# Altium project DMEM_Mezzanine.PrjPcb
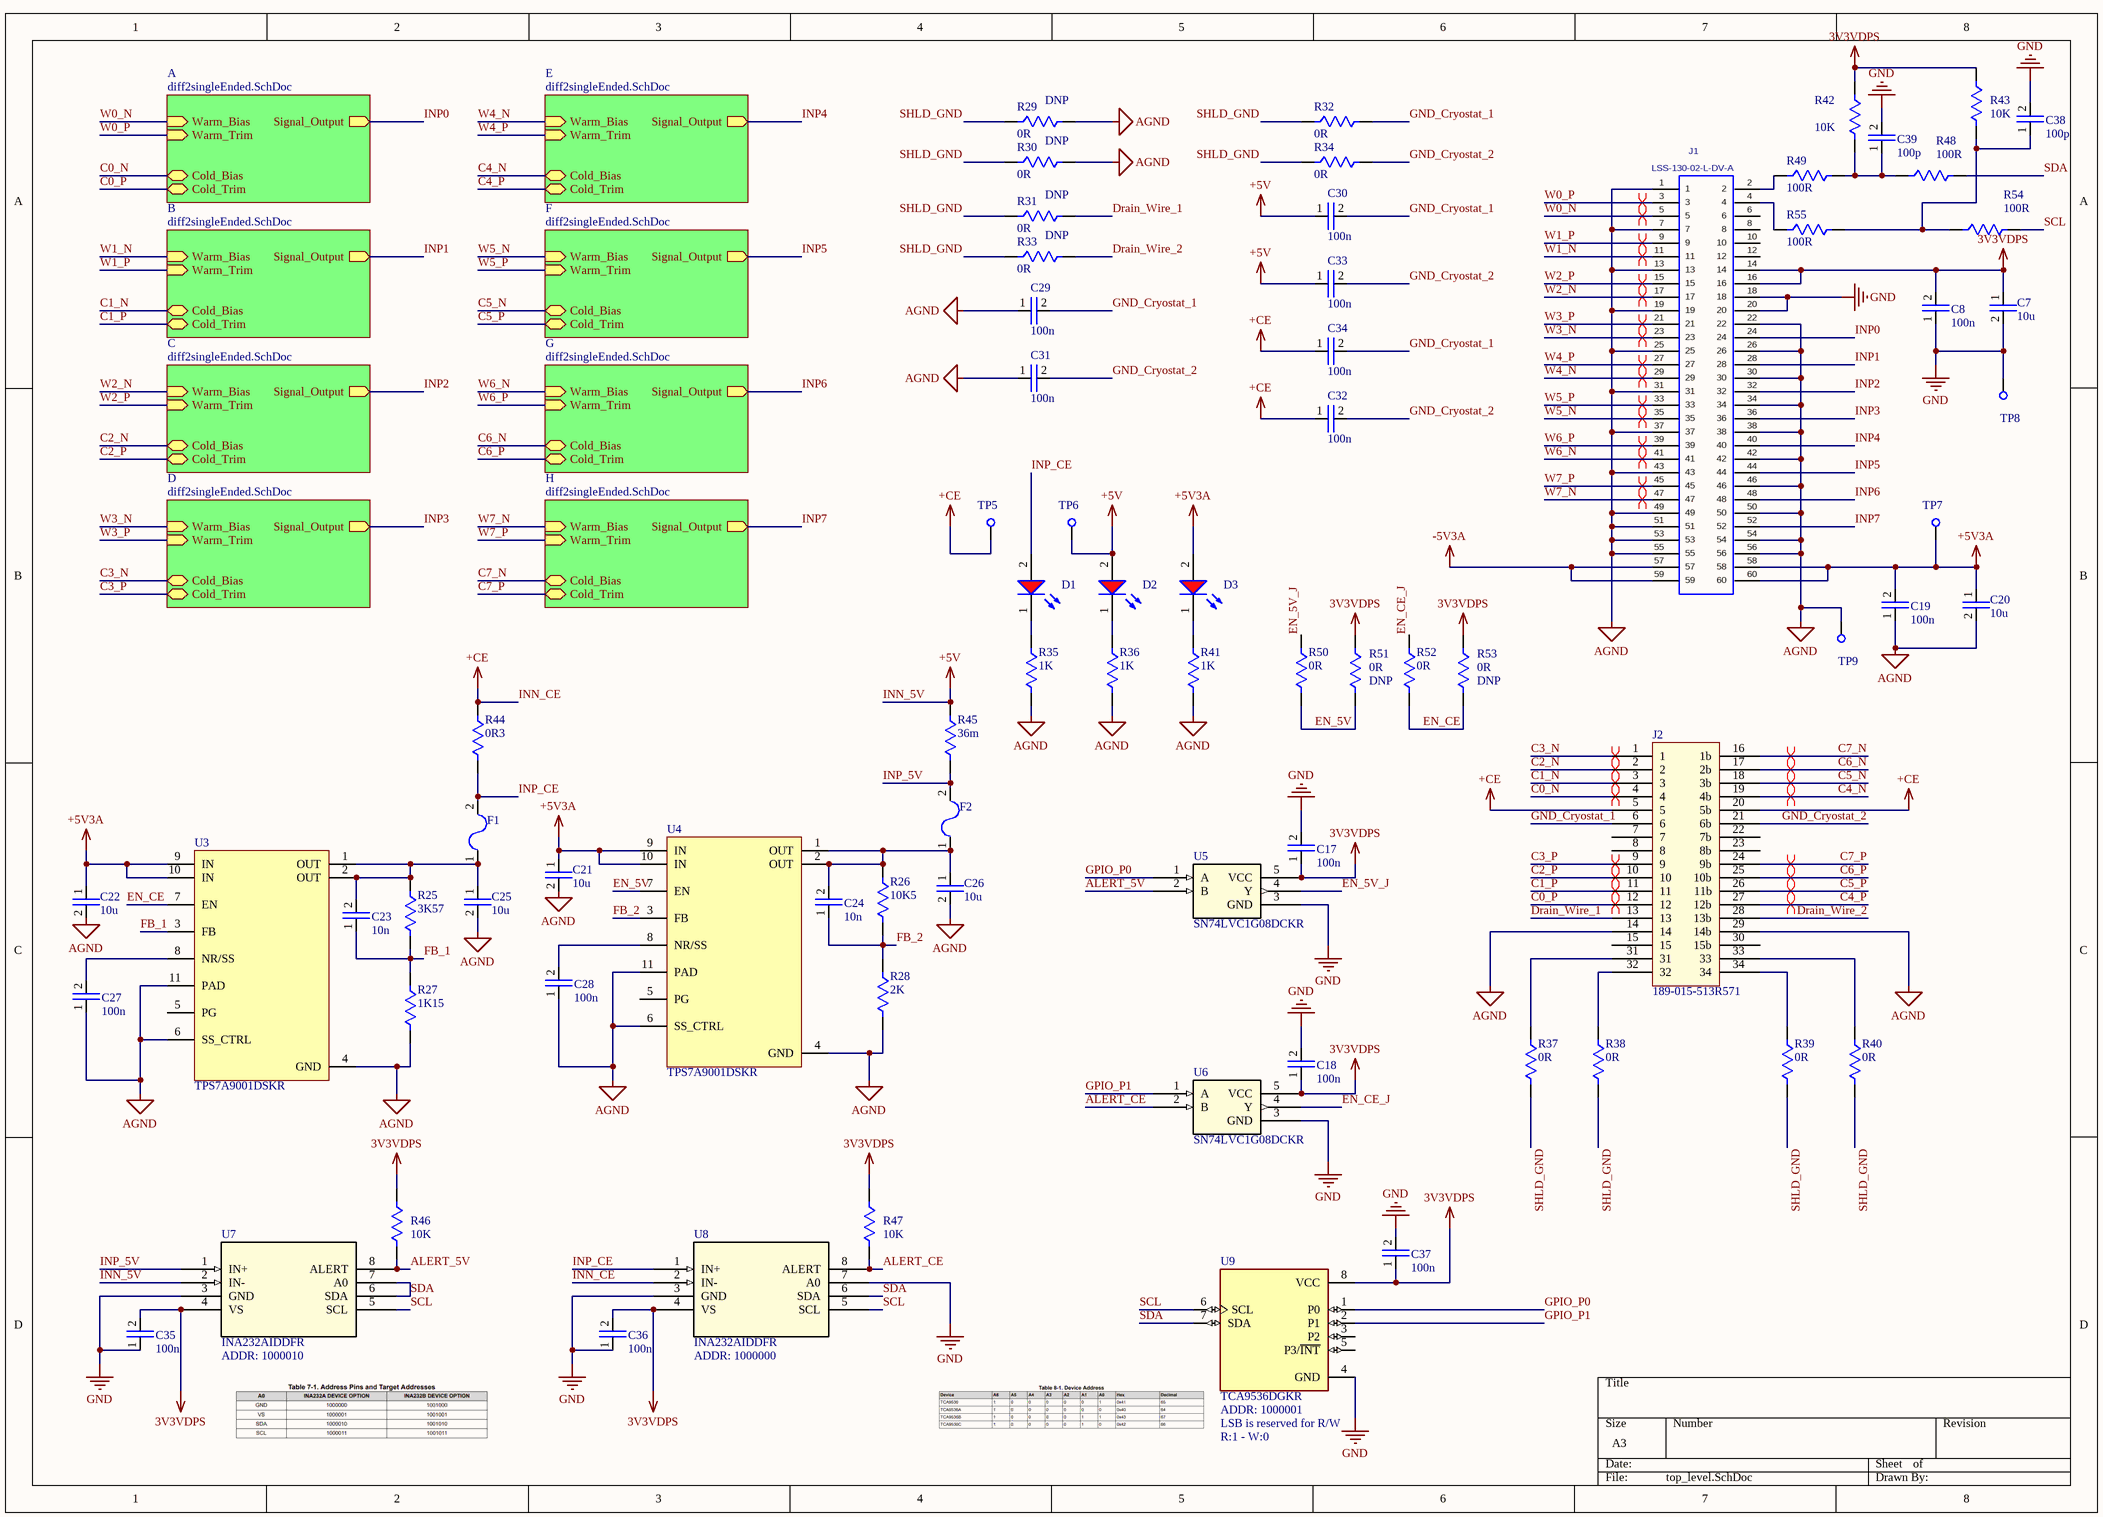
[diagram p0: top_level.SchDoc]
2 sheets, 443 parts. Net scope: hierarchical (ports join the sheet entries above them; power ports are global).
Board file: PCB_DMEM_Mezzanine.PcbDoc
Sheets:
  top_level.SchDoc
    A = diff2singleEnded.SchDoc
    B = diff2singleEnded.SchDoc
    C = diff2singleEnded.SchDoc
    D = diff2singleEnded.SchDoc
    E = diff2singleEnded.SchDoc
    F = diff2singleEnded.SchDoc
    G = diff2singleEnded.SchDoc
    H = diff2singleEnded.SchDoc

## Sheet top_level.SchDoc
size A3; SheetNumber: 1; SheetTotal: 2; SPICEModelCacheETIYLMLX: <root> / <DocumentId>ETIYLMLX</DocumentId> / <CacheFrame Number="0"> / <Model Name="0603_150060rs75000" Kind="CKT"> / <Text>****** / .subckt 0603_150060RS75000  1  2 / D1 1 2 SMCW / .MODEL SMCW D / + IS=39.260E-18 / + N=2.2264 / + RS=1.0000E-6 / + IKF=.13281 / + CJO=1.0000E-12 / + M=.3333 / + VJ=.75 / + BV=100 / + IBV=10.00E-6 / + TT=5.0000E-9 / .ends</Text> / </Model> / </CacheFrame> / </root>

### Parts
C7  value 10u  [CAPC3216X190N]  (hidden comment: C3216X6S2A106K160AC)
C8  value 100n  [CAPC1608X09N]  (hidden comment: CC0603KRX7R0BB104)
C17  value 100n  [CAPC1608X09N]  (hidden comment: CC0603KRX7R0BB104)
C18  value 100n  [CAPC1608X09N]  (hidden comment: CC0603KRX7R0BB104)
C19  value 100n  [CAPC1608X09N]  (hidden comment: CC0603KRX7R0BB104)
C20  value 10u  [CAPC3216X190N]  (hidden comment: C3216X6S2A106K160AC)
C21  value 10u  [CAPC3216X190N]  (hidden comment: C3216X6S2A106K160AC)
C22  value 10u  [CAPC3216X190N]  (hidden comment: C3216X6S2A106K160AC)
C23  value 10n  [CAPC1608X09N]  (hidden comment: 0603B103K500CT)
C24  value 10n  [CAPC1608X09N]  (hidden comment: 0603B103K500CT)
C25  value 10u  [CAPC3216X190N]  (hidden comment: C3216X6S2A106K160AC)
C26  value 10u  [CAPC3216X190N]  (hidden comment: C3216X6S2A106K160AC)
C27  value 100n  [CAPC1608X09N]  (hidden comment: CC0603KRX7R0BB104)
C28  value 100n  [CAPC1608X09N]  (hidden comment: CC0603KRX7R0BB104)
C29  value 100n  [CAPC1608X09N]  (hidden comment: CC0603KRX7R0BB104)
C30  value 100n  [CAPC1608X09N]  (hidden comment: CC0603KRX7R0BB104)
C31  value 100n  [CAPC1608X09N]  (hidden comment: CC0603KRX7R0BB104)
C32  value 100n  [CAPC1608X09N]  (hidden comment: CC0603KRX7R0BB104)
C33  value 100n  [CAPC1608X09N]  (hidden comment: CC0603KRX7R0BB104)
C34  value 100n  [CAPC1608X09N]  (hidden comment: CC0603KRX7R0BB104)
C35  value 100n  [CAPC1608X09N]  (hidden comment: CC0603KRX7R0BB104)
C36  value 100n  [CAPC1608X09N]  (hidden comment: CC0603KRX7R0BB104)
C37  value 100n  [CAPC1608X09N]  (hidden comment: CC0603KRX7R0BB104)
C38  value 100p  [CAPC1608X09N]  (hidden comment: GRM1885C1H101JA01D)
C39  value 100p  [CAPC1608X09N]  (hidden comment: GRM1885C1H101JA01D)
D1  150060RS75000  [WL-SMCW_0603_150060xx75000]  (value not drawn)
D2  150060RS75000  [WL-SMCW_0603_150060xx75000]  (value not drawn)
D3  150060RS75000  [WL-SMCW_0603_150060xx75000]  (value not drawn)
F1  F0603G0R20FNTR  [RESC1608X08N]  (value not drawn)
F2  F0603G0R20FNTR  [RESC1608X08N]  (value not drawn)
J1  LSS-130-02-L-DV-A  [LSS-130-XX-XX-DV-A]
J2  189-015-513R571  [189-015-513R571]
R25  value 3K57  [RESC1608X55N]  (hidden comment: RMCF0603FT3K57)
R26  value 10K5  [RESC1608X55N]  (hidden comment: RMCF0603FT10K5)
R27  value 1K15  [RESC1608X55N]  (hidden comment: RMCF0603FT1K15)
R28  value 2K  [RESC1608X55N]  (hidden comment: ERJ-3EKF2001V)
R29  DNP  value 0R  [RESC1608X55N]
R30  DNP  value 0R  [RESC1608X55N]
R31  DNP  value 0R  [RESC1608X55N]
R32  value 0R  [RESC1608X55N]  (hidden comment: RMCF0603ZT0R00)
R33  DNP  value 0R  [RESC1608X55N]
R34  value 0R  [RESC1608X55N]  (hidden comment: RMCF0603ZT0R00)
R35  value 1K  [RESC1608X55N]  (hidden comment: RT0603BRD071KL)
R36  value 1K  [RESC1608X55N]  (hidden comment: RT0603BRD071KL)
R37  value 0R  [RESC1608X55N]  (hidden comment: RMCF0603ZT0R00)
R38  value 0R  [RESC1608X55N]  (hidden comment: RMCF0603ZT0R00)
R39  value 0R  [RESC1608X55N]  (hidden comment: RMCF0603ZT0R00)
R40  value 0R  [RESC1608X55N]  (hidden comment: RMCF0603ZT0R00)
R41  value 1K  [RESC1608X55N]  (hidden comment: RT0603BRD071KL)
R42  value 10K  [RESC1608X55N]  (hidden comment: RC0603FR-0710KL)
R43  value 10K  [RESC1608X55N]  (hidden comment: RC0603FR-0710KL)
R44  value 0R3  [RESC1608X55N]  (hidden comment: ERJ-3RQFR30V)
R45  value 36m  [RESC1608X55N]  (hidden comment: ERJ-3BWFR036V)
R46  value 10K  [RESC1608X55N]  (hidden comment: RC0603FR-0710KL)
R47  value 10K  [RESC1608X55N]  (hidden comment: RC0603FR-0710KL)
R48  value 100R  [RESC1608X55N]  (hidden comment: RC0603FR-07100RL)
R49  value 100R  [RESC1608X55N]  (hidden comment: RC0603FR-07100RL)
R50  value 0R  [RESC1608X55N]  (hidden comment: RMCF0603ZT0R00)
R51  DNP  value 0R  [RESC1608X55N]
R52  value 0R  [RESC1608X55N]  (hidden comment: RMCF0603ZT0R00)
R53  DNP  value 0R  [RESC1608X55N]
R54  value 100R  [RESC1608X55N]  (hidden comment: RC0603FR-07100RL)
R55  value 100R  [RESC1608X55N]  (hidden comment: RC0603FR-07100RL)
TP5  testPoint_throughHole  [testPoint_ThroughHole]  (value not drawn)
TP6  testPoint_throughHole  [testPoint_ThroughHole]  (value not drawn)
TP7  testPoint_throughHole  [testPoint_ThroughHole]  (value not drawn)
TP8  testPoint_throughHole  [testPoint_ThroughHole]  (value not drawn)
TP9  testPoint_throughHole  [testPoint_ThroughHole]  (value not drawn)
U3  TPS7A9001DSKR  [SON50P250X250X80-11N]
U4  TPS7A9001DSKR  [SON50P250X250X80-11N]
U5  SN74LVC1G08DCKR  [DCK5]
U6  SN74LVC1G08DCKR  [DCK5]
U7  INA232AIDDFR  [SOT_32AIDDFR_TEX]
U8  INA232AIDDFR  [SOT_32AIDDFR_TEX]
U9  TCA9536DGKR  [SOP65P490X110-8N]

### Sub-sheets
A = diff2singleEnded.SchDoc: Warm_Bias (in), Warm_Trim (in), Cold_Bias (bidir), Cold_Trim (bidir), Signal_Output (out)
B = diff2singleEnded.SchDoc: Warm_Bias (in), Warm_Trim (in), Cold_Bias (bidir), Cold_Trim (bidir), Signal_Output (out)
C = diff2singleEnded.SchDoc: Warm_Bias (in), Warm_Trim (in), Cold_Bias (bidir), Cold_Trim (bidir), Signal_Output (out)
D = diff2singleEnded.SchDoc: Warm_Bias (in), Warm_Trim (in), Cold_Bias (bidir), Cold_Trim (bidir), Signal_Output (out)
E = diff2singleEnded.SchDoc: Warm_Bias (in), Warm_Trim (in), Cold_Bias (bidir), Cold_Trim (bidir), Signal_Output (out)
F = diff2singleEnded.SchDoc: Warm_Bias (in), Warm_Trim (in), Cold_Bias (bidir), Cold_Trim (bidir), Signal_Output (out)
G = diff2singleEnded.SchDoc: Warm_Bias (in), Warm_Trim (in), Cold_Bias (bidir), Cold_Trim (bidir), Signal_Output (out)
H = diff2singleEnded.SchDoc: Warm_Bias (in), Warm_Trim (in), Cold_Bias (bidir), Cold_Trim (bidir), Signal_Output (out)

### Nets
3V3VDPS: C7.1 C8.2 C17.1 C18.1 C35.2 C36.2 C37.1 J1.14 J1.16 R42.2 R43.2 R46.2 R47.2 R51.2 R53.2 U5.5(VCC) U6.5(VCC) U7.4(VS) U8.4(VS) U9.8(VCC)
+5V3A: C19.2 C20.1 C21.1 C22.1 D3.2(A) J1.58 J1.60 TP7.0 U3.9(IN) U3.10(IN) U4.9(IN) U4.10(IN)
-5V3A: J1.57 J1.59
AGND: C19.1 C20.2 C21.2 C22.2 C25.2 C26.2 C27.1 C28.1 C29.1 C31.1 J1.1 J1.7 J1.13 J1.19 J1.22 J1.25 J1.26 J1.30 J1.31 J1.34 J1.37 J1.38 J1.42 J1.43 J1.46 J1.49 J1.50 J1.51 J1.53 J1.54 J1.55 J1.56 J2.14 J2.29(14b) R27.1 R28.1 R29.1 R30.1 R35.1 R36.1 R41.1 TP9.0 U3.4(GND) U3.6(SS_CTRL) U3.11(PAD) U4.4(GND) U4.6(SS_CTRL) U4.11(PAD)
GND: C7.2 C8.1 C17.2 C18.2 C35.1 C36.1 C37.2 C38.2 C39.2 J1.18 J1.20 TP8.0 U5.3(GND) U6.3(GND) U7.3(GND) U8.3(GND) U8.7(A0) U9.4(GND)
INN_5V: C30.1 C33.1 D2.2(A) R45.2 TP6.0 U7.2(IN-)  [also labelled +5V]
INN_CE: C32.1 C34.1 J2.5 J2.20(5b) R44.2 TP5.0 U8.2(IN-)  [also labelled +CE]
ALERT_5V: R46.1 U5.2(B) U7.8(ALERT)
ALERT_CE: R47.1 U6.2(B) U8.8(ALERT)
C0_N: J2.4 ; sheet A/Cold_Bias
C0_P: J2.12 ; sheet A/Cold_Trim
C1_N: J2.3 ; sheet B/Cold_Bias
C1_P: J2.11 ; sheet B/Cold_Trim
C2_N: J2.2 ; sheet C/Cold_Bias
C2_P: J2.10 ; sheet C/Cold_Trim
C3_N: J2.1 ; sheet D/Cold_Bias
C3_P: J2.9 ; sheet D/Cold_Trim
C4_N: J2.19(4b) ; sheet E/Cold_Bias
C4_P: J2.27(12b) ; sheet E/Cold_Trim
C5_N: J2.18(3b) ; sheet F/Cold_Bias
C5_P: J2.26(11b) ; sheet F/Cold_Trim
C6_N: J2.17(2b) ; sheet G/Cold_Bias
C6_P: J2.25(10b) ; sheet G/Cold_Trim
C7_N: J2.16(1b) ; sheet H/Cold_Bias
C7_P: J2.24(9b) ; sheet H/Cold_Trim
Drain_Wire_1: J2.13 R31.1
Drain_Wire_2: J2.28(13b) R33.1
EN_5V: R50.1 R51.1 U4.7(EN)
EN_5V_J: R50.2 U5.4(Y)
EN_CE: R52.1 R53.1 U3.7(EN)
EN_CE_J: R52.2 U6.4(Y)
FB_1: C23.1 R25.1 R27.2 U3.3(FB)
FB_2: C24.1 R26.1 R28.2 U4.3(FB)
GND_Cryostat_1: C29.2 C30.2 C34.2 J2.6 R32.1
GND_Cryostat_2: C31.2 C32.2 C33.2 J2.21(6b) R34.1
GPIO_P0: U5.1(A) U9.1(P0)
GPIO_P1: U6.1(A) U9.2(P1)
INP0: J1.24 ; sheet A/Signal_Output
INP1: J1.28 ; sheet B/Signal_Output
INP2: J1.32 ; sheet C/Signal_Output
INP3: J1.36 ; sheet D/Signal_Output
INP4: J1.40 ; sheet E/Signal_Output
INP5: J1.44 ; sheet F/Signal_Output
INP6: J1.48 ; sheet G/Signal_Output
INP7: J1.52 ; sheet H/Signal_Output
INP_5V: F2.2 R45.1 U7.1(IN+)
INP_CE: D1.2(A) F1.2 R44.1 U8.1(IN+)
SCL: R54.1 U7.5(SCL) U8.5(SCL) U9.6(SCL)
SDA: R48.1 U7.6(SDA) U7.7(A0) U8.6(SDA) U9.7(SDA)
SHLD_GND: R29.2 R30.2 R31.2 R32.2 R33.2 R34.2 R37.1 R38.1 R39.1 R40.1
W0_N: J1.5 ; sheet A/Warm_Bias
W0_P: J1.3 ; sheet A/Warm_Trim
W1_N: J1.11 ; sheet B/Warm_Bias
W1_P: J1.9 ; sheet B/Warm_Trim
W2_N: J1.17 ; sheet C/Warm_Bias
W2_P: J1.15 ; sheet C/Warm_Trim
W3_N: J1.23 ; sheet D/Warm_Bias
W3_P: J1.21 ; sheet D/Warm_Trim
W4_N: J1.29 ; sheet E/Warm_Bias
W4_P: J1.27 ; sheet E/Warm_Trim
W5_N: J1.35 ; sheet F/Warm_Bias
W5_P: J1.33 ; sheet F/Warm_Trim
W6_N: J1.41 ; sheet G/Warm_Bias
W6_P: J1.39 ; sheet G/Warm_Trim
W7_N: J1.47 ; sheet H/Warm_Bias
W7_P: J1.45 ; sheet H/Warm_Trim
NetC23_2: C23.2 C25.1 F1.1 R25.2 U3.1(OUT) U3.2(OUT)
NetC24_2: C24.2 C26.1 F2.1 R26.2 U4.1(OUT) U4.2(OUT)
NetC27_2: C27.2 U3.8(NR/SS)
NetC28_2: C28.2 U4.8(NR/SS)
NetC38_1: C38.1 R43.1 R54.2 R55.1
NetC39_1: C39.1 R42.1 R48.2 R49.1
NetD1_1: D1.1(K) R35.2
NetD2_1: D2.1(K) R36.2
NetD3_1: D3.1(K) R41.2
NetJ1_2: J1.2 R49.2
NetJ1_4: J1.4 R55.2
NetJ2_31: J2.31 R37.2
NetJ2_32: J2.32 R38.2
NetJ2_33: J2.33 R40.2
NetJ2_34: J2.34 R39.2

Not connected (* = marked no-connect by the designer): J1 6 8 10 12; J2 7 8 15 22(7b) 23(8b) 30(15b); U3 5(PG); U4 5(PG); U9 3(P2) 5(P3/~{INT})

### Layout directives
differential pair: C0_N, C0_P, C1_N, C1_P, C2_N, C2_P, C3_N, C3_P, C4_N, C4_P, C5_N, C5_P, C6_N, C6_P, C7_N, C7_P, W0_N, W0_P, W1_N, W1_P, W2_N, W2_P, W3_N, W3_P, W4_N, W4_P, W5_N, W5_P, W6_N, W6_P, W7_N, W7_P

### Notes on the sheet
- (near U7) ADDR: 1000010
- (near U8) ADDR: 1000000
- (near U9) ADDR: 1000001
- (near U9) LSB is reserved for R/W
- R:1 - W:0

### Library data of the parts
C7 C20-C22 C25 C26 = Capacitor: 10 µF ±10% 100V Ceramic Capacitor X6S 1206 (3216 Metric); MP: C3216X6S2A106K160AC
C8 C17-C19 C27-C37 = Capacitor: 0.1 µF ±10% 100V Ceramic Capacitor X7R 0603 (1608 Metric); MP: CC0603KRX7R0BB104
C23 C24 = Capacitor: 10000 pF ±10% 50V Ceramic Capacitor X7R 0603 (1608 Metric); MP: 0603B103K500CT
C38 C39 = Capacitor: 100 pF ±5% 50V Ceramic Capacitor C0G, NP0 0603 (1608 Metric); MP: GRM1885C1H101JA01D
D1-D3 = 150060RS75000: WL-SMCW Mono-color Chip LED Waterclear, SMT, size 0603, Red, 2V, 140°; Manufacturer: Wurth Elektronik; Case/Size Code: 0603; Chip Technology: AlInGaP; Dominant Wavelength: 625nm; Luminous Intensity: 250mcd; Peak Wavelength: 630nm; Manufacturer Part Number: 150060RS75000; Category: Signal LEDs; Match Code: WL-SMCW; ComponentLink1Description: Website Link; ComponentLink1URL: https://www.we-online.com/redexpert/article/150060RS75000?ad; ComponentLink2Description: Datasheet Link; ComponentLink2URL: https://www.we-online.com/redexpert/spec/150060RS75000?ad; Mount: Surface Mount; Operating Temperature Max: 85°C; Operating Temperature Min: -40°C; Packaging: Tape and Reel; Length: 1.6mm; Width: 0.8mm; Height: 0.7mm; Emitting Color: Red; Forward Voltage: 2V; Viewing Angle: 140°
F1 F2 = Fuse: 200 mA AC 32 V DC Fuse Board Mount (Cartridge Style Excluded) Surface Mount 0603 (1608 Metric); MP: F0603G0R20FNTR
J1 = LSS-130-XX-XX-DV-A: 0.635MM TERMINAL/SOCKET COMB, 60 PINS.; MANUFACTURER: SAMTEC; CREATED: May 11, 2015 - Wendy Xin; PCB DECAL: LSS-130-XX-XX-DV-A
J2 = 189-015-513R571: 15, 15 Position D-Sub - Stacked Receptacle, Female Sockets Connector; MP: 189-015-513R571
R25 = Resistor: 3.57 kOhms ±1% 0.1W, 1/10W Chip Resistor 0603 (1608 Metric) Automotive AEC-Q200 Thick Film; Package: None; Price: None; MP: RMCF0603FT3K57; Availability: Unavailable
R26 = Resistor: 10.5 kOhms ±1% 0.1W, 1/10W Chip Resistor 0603 (1608 Metric) Automotive AEC-Q200 Thick Film; Package: None; Price: None; MP: RMCF0603FT10K5; Availability: Unavailable
R27 = Resistor: 1.15 kOhms ±1% 0.1W, 1/10W Chip Resistor 0603 (1608 Metric) Automotive AEC-Q200 Thick Film; Package: None; Price: None; MP: RMCF0603FT1K15; Availability: Unavailable
R28 = Resistor: 2 kOhms ±1% 0.1W, 1/10W Chip Resistor 0603 (1608 Metric) Automotive AEC-Q200 Thick Film; Package: None; Price: None; MP: ERJ-3EKF2001V; Availability: Unavailable
R29-R31 R33 R51 R53 = Resistor: 0 Ohms Jumper Chip Resistor 0603 (1608 Metric) Automotive AEC-Q200 Thick Film; MP: RMCF0603ZT0R00; Package: None; Price: None; Availability: Unavailable
R32 R34 R37-R40 R50 R52 = Resistor: 0 Ohms Jumper Chip Resistor 0603 (1608 Metric) Automotive AEC-Q200 Thick Film; Package: None; Price: None; MP: RMCF0603ZT0R00; Availability: Unavailable
R35 R36 R41 = Resistor: 1 kOhms ±0.1% 0.1W, 1/10W Chip Resistor 0603 (1608 Metric) Thin Film; Package: None; Price: None; MP: RT0603BRD071KL; Availability: Unavailable
R42 R43 R46 R47 = Resistor: 10 kOhms ±1% 0.1W, 1/10W Chip Resistor 0603 (1608 Metric) Moisture Resistant Thick Film; Package: None; Price: None; MP: RC0603FR-0710KL; Availability: Unavailable
R44 = Resistor: 300 mOhms ±1% 0.1W, 1/10W Chip Resistor 0603 (1608 Metric) Automotive AEC-Q200 Thick Film; Package: None; Price: None; MP: ERJ-3RQFR30V; Availability: Unavailable
R45 = Resistor: 36 mOhms ±1% 0.333W, 1/3W Chip Resistor 0603 (1608 Metric) Automotive AEC-Q200, Current Sense Thick Film; Package: None; Price: None; MP: ERJ-3BWFR036V; Availability: Unavailable
R48 R49 R54 R55 = Resistor: 100 Ohms ±1% 0.1W, 1/10W Chip Resistor 0603 (1608 Metric) Moisture Resistant Thick Film; Package: None; Price: None; MP: RC0603FR-07100RL; Availability: Unavailable
U3 U4 = TPS7A9001DSKR: 500-mA, low-noise, high-PSRR, adjustable ultra-low-dropout voltage regulator with high-accuracy 10-SON -40 to 125; MF: Texas Instruments; Purchase-URL: https://pricing.snapeda.com/search/part/TPS7A9001DSKR/?ref=eda; Price: None; Value: *; Check_prices: https://www.snapeda.com/parts/TPS7A9001DSKR/Texas+Instruments/view-part/?ref=eda; SnapEDA_Link: https://www.snapeda.com/parts/TPS7A9001DSKR/Texas+Instruments/view-part/?ref=snap; Package: WSON-10 Texas Instruments; Availability: In Stock; MP: TPS7A9001DSKR
U5 U6 = SN74LVC1G08DCKR: AND Gate IC 1 Channel SC-70-5; Mfr_Name: Texas Instruments; RefDes: RefDes; Type: Type
U7 U8 = INA232AIDDFR: Current Monitor Regulator High/Low-Side TSOT-23-8; Mfr_Name: Texas Instruments; RefDes: RefDes; Type: Type
U9 = TCA9536DGKR: Remote 4-Bit IÂ²C and SMBus I/O expander with configuration registers; MF: Texas Instruments; Package: None; MP: TCA9536DGKR; Price: None; Availability: In Stock; Purchase-URL: https://pricing.snapeda.com/search/part/TCA9536DGKR/?ref=eda; Check_prices: https://www.snapeda.com/parts/TCA9536DGKR/Texas+Instruments/view-part/?ref=eda; Value: *; SnapEDA_Link: https://www.snapeda.com/parts/TCA9536DGKR/Texas+Instruments/view-part/?ref=snap

## Sheet diff2singleEnded.SchDoc
size A4; SheetNumber: 2; SheetTotal: 2
Used 8 times, as channels A, B, C, D, E, F, G, H. Parts and nets are listed once, with the designators drawn on the sheet.
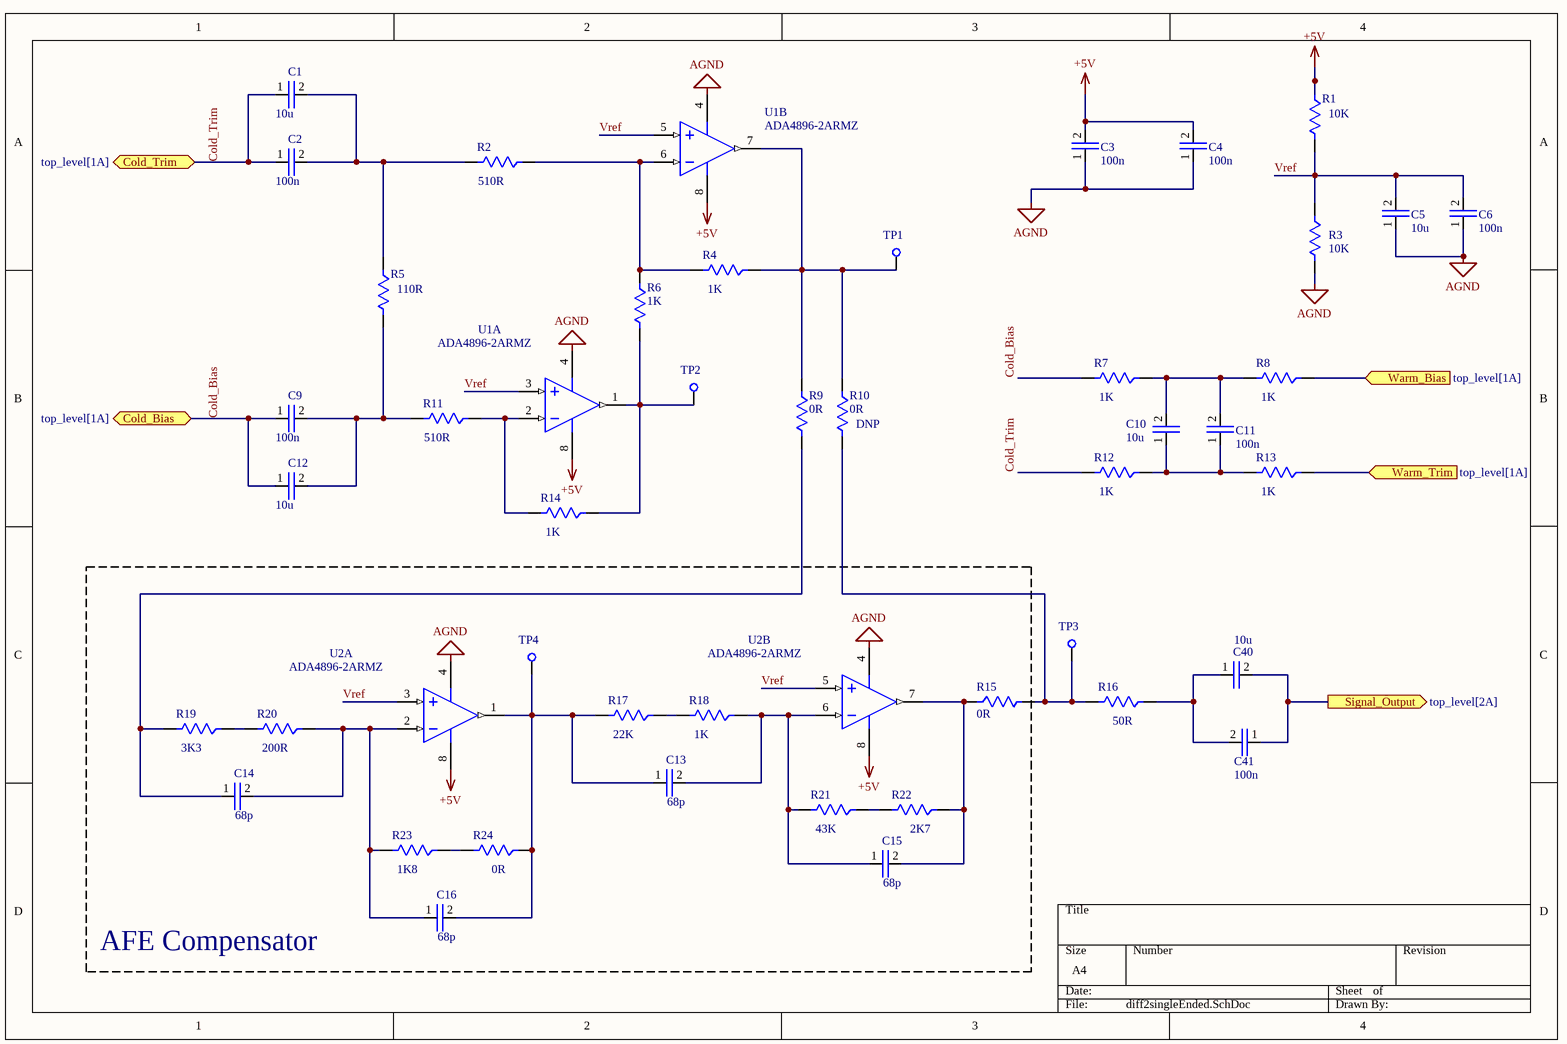
[diagram p1: diff2singleEnded.SchDoc]

### Parts
C1  value 10u  [CAPC3216X190N]  (hidden comment: C3216X6S2A106K160AC)
C2  value 100n  [CAPC1608X09N]  (hidden comment: CC0603KRX7R0BB104)
C3  value 100n  [CAPC1608X09N]  (hidden comment: CC0603KRX7R0BB104)
C4  value 100n  [CAPC1608X09N]  (hidden comment: CC0603KRX7R0BB104)
C5  value 10u  [CAPC3216X190N]  (hidden comment: CL31A106KPHNNNE)
C6  value 100n  [CAPC1608X09N]  (hidden comment: CC0603KRX7R0BB104)
C9  value 100n  [CAPC1608X09N]  (hidden comment: CC0603KRX7R0BB104)
C10  value 10u  [CAPC3216X190N]  (hidden comment: C3216X6S2A106K160AC)
C11  value 100n  [CAPC1608X09N]  (hidden comment: CC0603KRX7R0BB104)
C12  value 10u  [CAPC3216X190N]  (hidden comment: C3216X6S2A106K160AC)
C13  value 68p  [CAPC1608X09N]  (hidden comment: GCM1885C2A680FA16D)
C14  value 68p  [CAPC1608X09N]  (hidden comment: GCM1885C2A680FA16D)
C15  value 68p  [CAPC1608X09N]  (hidden comment: GCM1885C2A680FA16D)
C16  value 68p  [CAPC1608X09N]  (hidden comment: GCM1885C2A680FA16D)
C40  value 10u  [CAPC1608X09N]  (hidden comment: CL10A106KP8NNNC)
C41  value 100n  [CAPC1608X09N]  (hidden comment: CC0603KRX7R0BB104)
R1  value 10K  [RESC1608X55N]  (hidden comment: RC0603FR-0710KL)
R2  value 510R  [RESC1608X55N]  (hidden comment: RT0603BRD07510RL)
R3  value 10K  [RESC1608X55N]  (hidden comment: RC0603FR-0710KL)
R4  value 1K  [RESC1608X55N]  (hidden comment: RT0603BRD071KL)
R5  value 110R  [RESC1608X55N]  (hidden comment: RT0603BRD07110RL)
R6  value 1K  [RESC1608X55N]  (hidden comment: RT0603BRD071KL)
R7  value 1K  [RESC1608X55N]  (hidden comment: RT0603BRD071KL)
R8  value 1K  [RESC1608X55N]  (hidden comment: RT0603BRD071KL)
R9  value 0R  [RESC1608X55N]  (hidden comment: RMCF0603ZT0R00)
R10  DNP  value 0R  [RESC1608X55N]
R11  value 510R  [RESC1608X55N]  (hidden comment: RT0603BRD07510RL)
R12  value 1K  [RESC1608X55N]  (hidden comment: RT0603BRD071KL)
R13  value 1K  [RESC1608X55N]  (hidden comment: RT0603BRD071KL)
R14  value 1K  [RESC1608X55N]  (hidden comment: RT0603BRD071KL)
R15  value 0R  [RESC1608X55N]  (hidden comment: RMCF0603ZT0R00)
R16  value 50R  [RESC1608X55N]  (hidden comment: RT0603BRE0750RL)
R17  value 22K  [RESC1608X55N]  (hidden comment: RT0603BRE0722KL)
R18  value 1K  [RESC1608X55N]  (hidden comment: RT0603BRD071KL)
R19  value 3K3  [RESC1608X55N]  (hidden comment: RT0603BRD073K3L)
R20  value 200R  [RESC1608X55N]  (hidden comment: RT0603BRD07200RL)
R21  value 43K  [RESC1608X55N]  (hidden comment: RT0603BRD0743KL)
R22  value 2K7  [RESC1608X55N]  (hidden comment: RT0603BRD072K7L)
R23  value 1K8  [RESC1608X55N]  (hidden comment: RT0603BRD071K8L)
R24  value 0R  [RESC1608X55N]  (hidden comment: RMCF0603ZT0R00)
TP1  testPoint  [testPoint_pad]  (value not drawn)
TP2  testPoint  [testPoint_pad]  (value not drawn)
TP3  testPoint  [testPoint_pad]  (value not drawn)
TP4  testPoint  [testPoint_pad]  (value not drawn)
U1  ADA4896-2ARMZ  [ADI-RM-8_N]  (parts A,B of 2)
U2  ADA4896-2ARMZ  [ADI-RM-8_N]  (parts A,B of 2)

### Blocks framed on the sheet
AFE Compensator: C13-C16 R15 R17-R24 TP4 U2

### Ports
Cold_Bias (bidir, see top_level[1A]), Cold_Trim (bidir, see top_level[1A]), Signal_Output (out, see top_level[2A]), Warm_Bias (in, see top_level[1A]), Warm_Trim (in, see top_level[1A])

### Nets
+5V: C3.2 C4.2 R1.2 U1.8(+VS) U2.8(+VS)
AGND: C3.1 C4.1 C5.1 C6.1 R3.1 U1.4(-VS) U2.4(-VS)
Cold_Bias: C9.1 C12.1 R7.1 ; port Cold_Bias
Cold_Trim: C1.1 C2.1 R12.1 ; port Cold_Trim
Signal_Output: C40.2 C41.1 ; port Signal_Output
Vref: C5.2 C6.2 R1.1 R3.2 U1.3(+IN_1) U1.5(+IN_2) U2.3(+IN_1) U2.5(+IN_2)
Warm_Bias: R8.2 ; port Warm_Bias
Warm_Trim: R13.2 ; port Warm_Trim
NetC1_2: C1.2 C2.2 R2.1 R5.2
NetC9_2: C9.2 C12.2 R5.1 R11.1
NetC10_1: C10.1 C11.1 R12.2 R13.1
NetC10_2: C10.2 C11.2 R7.2 R8.1
NetC13_1: C13.1 C16.2 R17.1 R24.2 TP4.0 U2.1(OUT_1)
NetC13_2: C13.2 C15.1 R18.2 R21.1 U2.6(-IN_2)
NetC14_1: C14.1 R9.1 R19.1
NetC14_2: C14.2 C16.1 R20.2 R23.1 U2.2(-IN_1)
NetC15_2: C15.2 R15.2 R22.2 U2.7(OUT_2)
NetC40_1: C40.1 C41.2 R16.2
NetR2_2: R2.2 R4.1 R6.2 U1.6(-IN_2)
NetR4_2: R4.2 R9.2 R10.2 TP1.0 U1.7(OUT_2)
NetR6_1: R6.1 R14.2 TP2.0 U1.1(OUT_1)
NetR10_1: R10.1 R15.1 R16.1 TP3.0
NetR11_2: R11.2 R14.1 U1.2(-IN_1)
NetR17_2: R17.2 R18.1
NetR19_2: R19.2 R20.1
NetR21_2: R21.2 R22.1
NetR23_2: R23.2 R24.1

### Channels
A: designators end in _A; ports Cold_Bias=C0_N Cold_Trim=C0_P Signal_Output=INP0 Warm_Bias=W0_N Warm_Trim=W0_P
B: designators end in _B; ports Cold_Bias=C1_N Cold_Trim=C1_P Signal_Output=INP1 Warm_Bias=W1_N Warm_Trim=W1_P
C: designators end in _C; ports Cold_Bias=C2_N Cold_Trim=C2_P Signal_Output=INP2 Warm_Bias=W2_N Warm_Trim=W2_P
D: designators end in _D; ports Cold_Bias=C3_N Cold_Trim=C3_P Signal_Output=INP3 Warm_Bias=W3_N Warm_Trim=W3_P
E: designators end in _E; ports Cold_Bias=C4_N Cold_Trim=C4_P Signal_Output=INP4 Warm_Bias=W4_N Warm_Trim=W4_P
F: designators end in _F; ports Cold_Bias=C5_N Cold_Trim=C5_P Signal_Output=INP5 Warm_Bias=W5_N Warm_Trim=W5_P
G: designators end in _G; ports Cold_Bias=C6_N Cold_Trim=C6_P Signal_Output=INP6 Warm_Bias=W6_N Warm_Trim=W6_P
H: designators end in _H; ports Cold_Bias=C7_N Cold_Trim=C7_P Signal_Output=INP7 Warm_Bias=W7_N Warm_Trim=W7_P

### Library data of the parts
C1 C10 C12 = Capacitor: as C7 on sheet top_level; MP: C3216X6S2A106K160AC
C2-C4 C6 C9 C11 C41 = Capacitor: as C8 on sheet top_level; MP: CC0603KRX7R0BB104
C5 = Capacitor: 10 µF ±10% 10V Ceramic Capacitor X5R 1206 (3216 Metric); MP: CL31A106KPHNNNE
C13-C16 = Capacitor: 68 pF ±1% 100V Ceramic Capacitor C0G, NP0 0603 (1608 Metric); MP: GCM1885C2A680FA16D
C40 = Capacitor: 10 µF ±10% 10V Ceramic Capacitor X5R 0603 (1608 Metric); MP: CL10A106KP8NNNC
R1 R3 = Resistor: as R42 on sheet top_level; Package: None; Price: None; MP: RC0603FR-0710KL; Availability: Unavailable
R2 R11 = Resistor: 510 Ohms ±0.1% 0.1W, 1/10W Chip Resistor 0603 (1608 Metric) Thin Film; Package: None; Price: None; MP: RT0603BRD07510RL; Availability: Unavailable
  R2: Manufacturer 1: *
R4 R6-R8 R12-R14 R18 = Resistor: as R35 on sheet top_level; Package: None; Price: None; MP: RT0603BRD071KL; Availability: Unavailable
R5 = Resistor: 110 Ohms ±0.1% 0.1W, 1/10W Chip Resistor 0603 (1608 Metric) Thin Film; Package: None; Price: None; MP: RT0603BRD07110RL; Availability: Unavailable
R9 R15 R24 = Resistor: as R32 on sheet top_level; Package: None; Price: None; MP: RMCF0603ZT0R00; Availability: Unavailable
R10 = Resistor: as R29 on sheet top_level; Package: None; Price: None; Availability: Unavailable
R16 = Resistor: 50 Ohms ±0.1% 0.1W, 1/10W Chip Resistor 0603 (1608 Metric) Thin Film; Package: None; Price: None; MP: RT0603BRE0750RL; Availability: Unavailable
R17 = Resistor: 22 kOhms ±0.1% 0.1W, 1/10W Chip Resistor 0603 (1608 Metric) Thin Film; Package: None; Price: None; MP: RT0603BRE0722KL; Availability: Unavailable
R19 = Resistor: 3.3 kOhms ±0.1% 0.1W, 1/10W Chip Resistor 0603 (1608 Metric) Thin Film; Package: None; Price: None; MP: RT0603BRD073K3L; Availability: Unavailable
R20 = Resistor: 200 Ohms ±0.1% 0.1W, 1/10W Chip Resistor 0603 (1608 Metric) Thin Film; Package: None; Price: None; MP: RT0603BRD07200RL; Availability: Unavailable
R21 = Resistor: 43 kOhms ±0.1% 0.1W, 1/10W Chip Resistor 0603 (1608 Metric) Thin Film; Package: None; Price: None; MP: RT0603BRD0743KL; Availability: Unavailable
R22 = Resistor: 2.7 kOhms ±0.1% 0.1W, 1/10W Chip Resistor 0603 (1608 Metric) Thin Film; Package: None; Price: None; MP: RT0603BRD072K7L; Availability: Unavailable
R23 = Resistor: 1.8 kOhms ±0.1% 0.1W, 1/10W Chip Resistor 0603 (1608 Metric) Thin Film; Package: None; Price: None; MP: RT0603BRD071K8L; Availability: Unavailable
U1 U2 = CMP-0384-01715-1: Double Channel Low Wide Band Noise Operational Amplifier, 230 MHz BW, 120 V/us SR, Industrial, 8-pin SOP (RM-8), Tube; Manufacturer: Analog Devices; Amplifiers Per Package: 2; Iq/Amp: 3mA; Input Bias Current: 11uA; Small Signal Bandwidth: 230MHz; Input Offset Voltage: 28uV; V Span Min: 3V; V Span Max: 10V; Packing: Tube; Code_JEDEC: MO-187-AA; PartNumber: ADA4896-2ARMZ; PackageReference: RM-8; Slew Rate: 120V/us; Generic Part Number: ADA4896-2; ComponentLink3URL: http://www.analog.com/static/imported-files/packages/PKG_PDF/MSOP%28RM%29/RM_8.pdf; ComponentLink3Description: Package Specification; ComponentLink1Description: Manufacturer URL; ComponentLink2URL: http://www.analog.com/static/imported-files/data_sheets/ADA4896-2_4897-1_4897-2.PDF; DatasheetVersion: Rev. B; ComponentLink1URL: http://www.analog.com/en/index.html; PackageDescription: 8-Pin Mini Small Outline Package, Body 3 x 3 mm, Pitch 0.65 mm; Mounting Technology: Surface Mount; ComponentLink2Description: Datasheet

## Nets that join several sheets
AGND: top_level (48 pins), A (7 pins), B (7 pins), C (7 pins), D (7 pins), E (7 pins), F (7 pins), G (7 pins), H (7 pins)
INN_5V: top_level (6 pins), A (5 pins), B (5 pins), C (5 pins), D (5 pins), E (5 pins), F (5 pins), G (5 pins), H (5 pins)
C0_N: top_level (J2.4), A (C9_A.1 C12_A.1 R7_A.1)
C0_P: top_level (J2.12), A (C1_A.1 C2_A.1 R12_A.1)
C1_N: top_level (J2.3), B (C9_B.1 C12_B.1 R7_B.1)
C1_P: top_level (J2.11), B (C1_B.1 C2_B.1 R12_B.1)
C2_N: top_level (J2.2), C (C9_C.1 C12_C.1 R7_C.1)
C2_P: top_level (J2.10), C (C1_C.1 C2_C.1 R12_C.1)
C3_N: top_level (J2.1), D (C9_D.1 C12_D.1 R7_D.1)
C3_P: top_level (J2.9), D (C1_D.1 C2_D.1 R12_D.1)
C4_N: top_level (J2.19), E (C9_E.1 C12_E.1 R7_E.1)
C4_P: top_level (J2.27), E (C1_E.1 C2_E.1 R12_E.1)
C5_N: top_level (J2.18), F (C9_F.1 C12_F.1 R7_F.1)
C5_P: top_level (J2.26), F (C1_F.1 C2_F.1 R12_F.1)
C6_N: top_level (J2.17), G (C9_G.1 C12_G.1 R7_G.1)
C6_P: top_level (J2.25), G (C1_G.1 C2_G.1 R12_G.1)
C7_N: top_level (J2.16), H (C9_H.1 C12_H.1 R7_H.1)
C7_P: top_level (J2.24), H (C1_H.1 C2_H.1 R12_H.1)
INP0: top_level (J1.24), A (C40_A.2 C41_A.1)
INP1: top_level (J1.28), B (C40_B.2 C41_B.1)
INP2: top_level (J1.32), C (C40_C.2 C41_C.1)
INP3: top_level (J1.36), D (C40_D.2 C41_D.1)
INP4: top_level (J1.40), E (C40_E.2 C41_E.1)
INP5: top_level (J1.44), F (C40_F.2 C41_F.1)
INP6: top_level (J1.48), G (C40_G.2 C41_G.1)
INP7: top_level (J1.52), H (C40_H.2 C41_H.1)
W0_N: top_level (J1.5), A (R8_A.2)
W0_P: top_level (J1.3), A (R13_A.2)
W1_N: top_level (J1.11), B (R8_B.2)
W1_P: top_level (J1.9), B (R13_B.2)
W2_N: top_level (J1.17), C (R8_C.2)
W2_P: top_level (J1.15), C (R13_C.2)
W3_N: top_level (J1.23), D (R8_D.2)
W3_P: top_level (J1.21), D (R13_D.2)
W4_N: top_level (J1.29), E (R8_E.2)
W4_P: top_level (J1.27), E (R13_E.2)
W5_N: top_level (J1.35), F (R8_F.2)
W5_P: top_level (J1.33), F (R13_F.2)
W6_N: top_level (J1.41), G (R8_G.2)
W6_P: top_level (J1.39), G (R13_G.2)
W7_N: top_level (J1.47), H (R8_H.2)
W7_P: top_level (J1.45), H (R13_H.2)